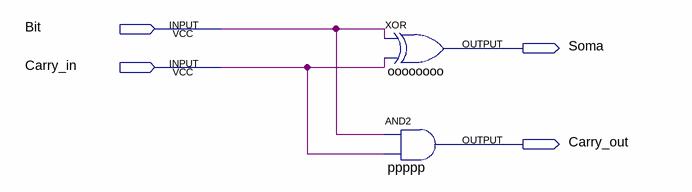
[diagram p0: schematic sheet]
// Quartus schematic full_adder_bit_a_bit_.bdf as structural Verilog: 2 symbols, 4 pins
module full_adder_bit_a_bit_ (
  input  Bit,
  input  Carry_in,
  output Soma,
  output Carry_out
);

  xor oooooooo (Soma, Bit, Carry_in);
  and ppppp (Carry_out, Bit, Carry_in);
endmodule
